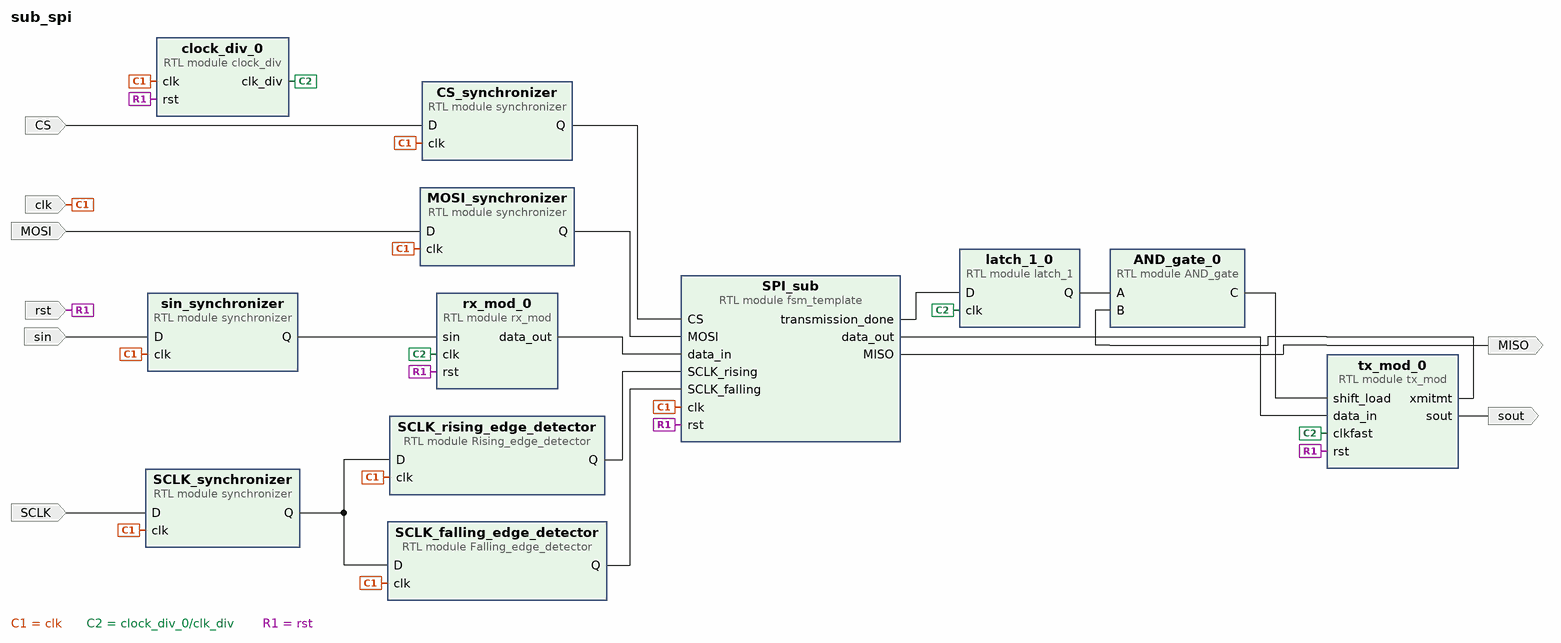
[diagram p0: block diagram of the top level]
# Vivado block design sub_spi, xc7z020clg400-1, Vivado 2023.2
create_bd_design sub_spi

create_bd_port -dir O MISO
create_bd_port -dir I -type clk clk
create_bd_port -dir I MOSI
create_bd_port -dir I SCLK
create_bd_port -dir I CS
create_bd_port -dir I -type rst rst
create_bd_port -dir O sout
create_bd_port -dir I sin

create_bd_cell -type module -reference fsm_template SPI_sub
set_property -dict {CONFIG.n_bits 8} [get_bd_cells SPI_sub]
create_bd_cell -type module -reference synchronizer MOSI_synchronizer
create_bd_cell -type module -reference synchronizer SCLK_synchronizer
create_bd_cell -type module -reference synchronizer CS_synchronizer
create_bd_cell -type module -reference Rising_edge_detector SCLK_rising_edge_detector
create_bd_cell -type module -reference Falling_edge_detector SCLK_falling_edge_detector
create_bd_cell -type module -reference tx_mod tx_mod_0
create_bd_cell -type module -reference clock_div clock_div_0
set_property -dict {CONFIG.half_val 407 CONFIG.n_bits 10} [get_bd_cells clock_div_0]
create_bd_cell -type module -reference rx_mod rx_mod_0
create_bd_cell -type module -reference synchronizer sin_synchronizer
create_bd_cell -type module -reference AND_gate AND_gate_0
create_bd_cell -type module -reference latch_1 latch_1_0

# ---- connections ----

connect_bd_net [get_bd_pins AND_gate_0/C] [get_bd_pins tx_mod_0/shift_load]
connect_bd_net [get_bd_pins CS_synchronizer/Q] [get_bd_pins SPI_sub/CS]
connect_bd_net -net D_0_1 [get_bd_ports MOSI] [get_bd_pins MOSI_synchronizer/D]
connect_bd_net -net D_0_2 [get_bd_ports SCLK] [get_bd_pins SCLK_synchronizer/D]
connect_bd_net -net D_0_3 [get_bd_ports CS] [get_bd_pins CS_synchronizer/D]
connect_bd_net [get_bd_pins MOSI_synchronizer/Q] [get_bd_pins SPI_sub/MOSI]
connect_bd_net [get_bd_pins SCLK_falling_edge_detector/Q] [get_bd_pins SPI_sub/SCLK_falling]
connect_bd_net [get_bd_pins SCLK_rising_edge_detector/Q] [get_bd_pins SPI_sub/SCLK_rising]
connect_bd_net [get_bd_pins SCLK_synchronizer/Q] [get_bd_pins SCLK_rising_edge_detector/D] [get_bd_pins SCLK_falling_edge_detector/D]
connect_bd_net [get_bd_pins SPI_sub/data_out] [get_bd_pins tx_mod_0/data_in]
connect_bd_net [get_bd_pins SPI_sub/transmission_done] [get_bd_pins latch_1_0/D]
connect_bd_net -net clk_0_1 [get_bd_ports clk] \
  [get_bd_pins SPI_sub/clk] [get_bd_pins MOSI_synchronizer/clk] [get_bd_pins SCLK_synchronizer/clk] \
  [get_bd_pins CS_synchronizer/clk] [get_bd_pins SCLK_rising_edge_detector/clk] [get_bd_pins SCLK_falling_edge_detector/clk] \
  [get_bd_pins sin_synchronizer/clk] [get_bd_pins clock_div_0/clk]
connect_bd_net [get_bd_pins clock_div_0/clk_div] [get_bd_pins rx_mod_0/clk] [get_bd_pins tx_mod_0/clkfast] [get_bd_pins latch_1_0/clk]
connect_bd_net -net fsm_template_0_MISO [get_bd_pins SPI_sub/MISO] [get_bd_ports MISO]
connect_bd_net [get_bd_pins latch_1_0/Q] [get_bd_pins AND_gate_0/A]
connect_bd_net -net rst_0_1 [get_bd_ports rst] \
  [get_bd_pins rx_mod_0/rst] [get_bd_pins SPI_sub/rst] [get_bd_pins tx_mod_0/rst] [get_bd_pins clock_div_0/rst]
connect_bd_net [get_bd_pins rx_mod_0/data_out] [get_bd_pins SPI_sub/data_in]
connect_bd_net [get_bd_ports sin] [get_bd_pins sin_synchronizer/D]
connect_bd_net -net synchronizer_0_Q [get_bd_pins sin_synchronizer/Q] [get_bd_pins rx_mod_0/sin]
connect_bd_net [get_bd_pins tx_mod_0/sout] [get_bd_ports sout]
connect_bd_net [get_bd_pins tx_mod_0/xmitmt] [get_bd_pins AND_gate_0/B]

validate_bd_design
save_bd_design
